# Altium schematic sheet 0043_GPP_MUX_E.SchDoc
size A3
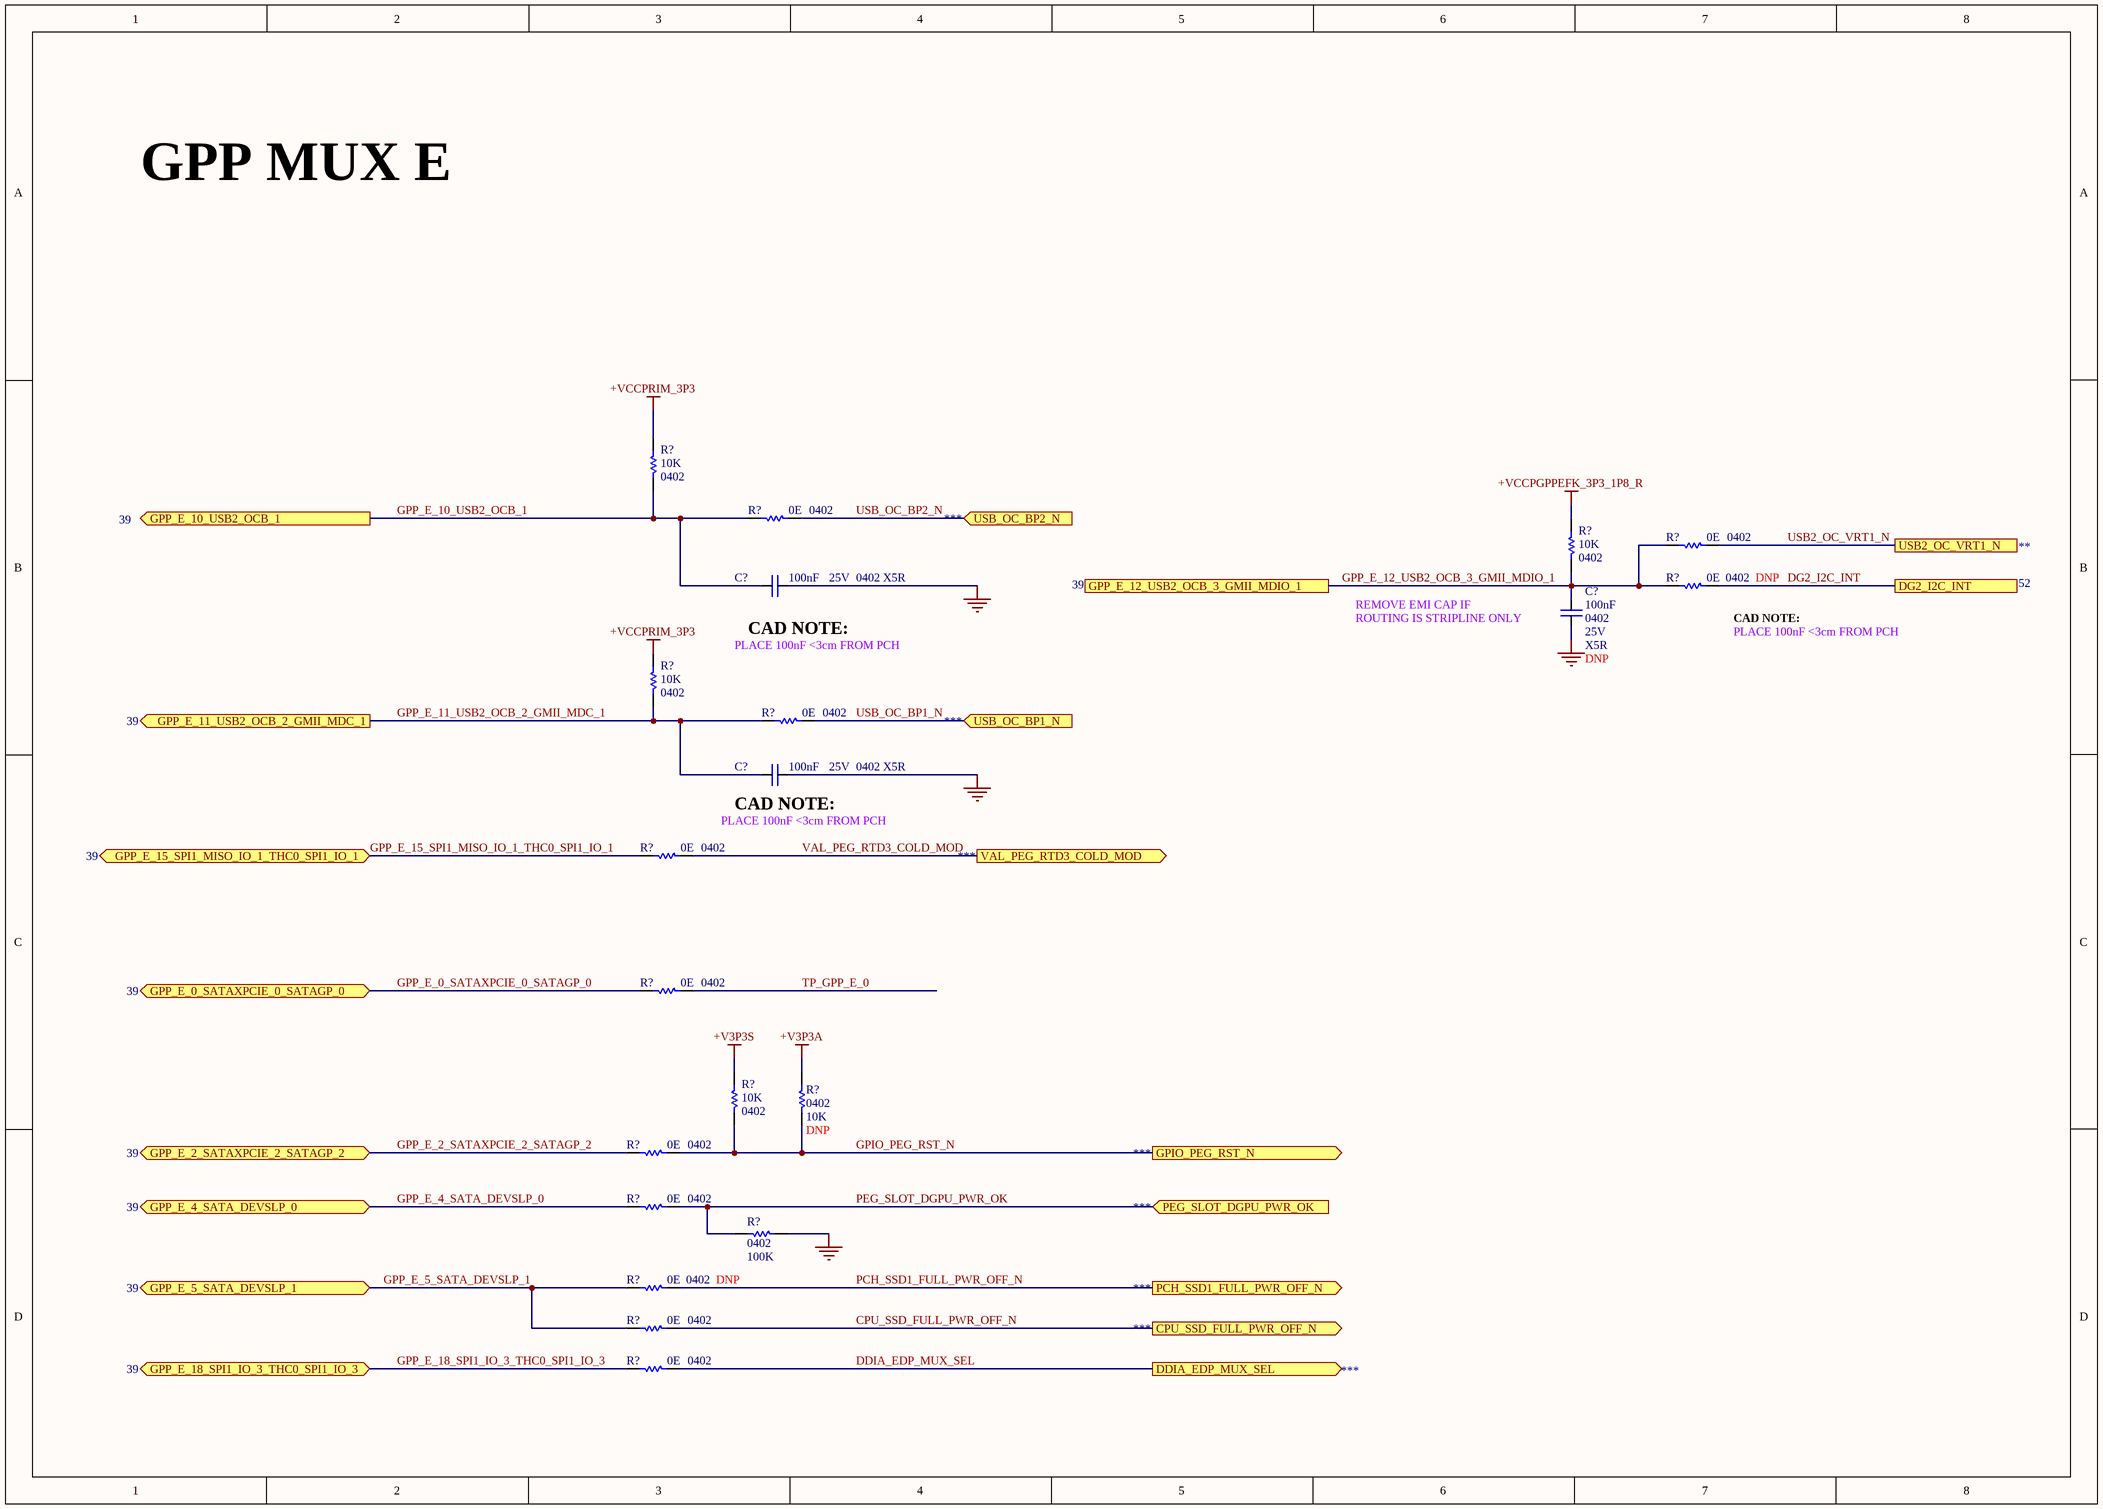
[diagram p0: 0043_GPP_MUX_E.SchDoc]

## Parts
(Parts that share a designator on the sheet are numbered #1, #2 ... from top to bottom, then left to right.)
C?#1  value 100nF  Case/Package: 0402  Voltage: 25V  Dielectric: X5R  [CAPC0402]
C?#2  value 100nF  Case/Package: 0402  Voltage: 25V  Dielectric: X5R  [CAPC0402]
C?#3  value 100nF  Case/Package: 0402  Voltage: 25V  Dielectric: X5R  [CAPC0402]
R?#1  value 10K  Case/Package: 0402  [RESC0402]  (hidden comment: Res)
R?#2  value 0E  Case/Package: 0402  [RESC0402]  (hidden comment: Res)
R?#3  value 10K  Case/Package: 0402  [RESC0402]  (hidden comment: Res)
R?#4  value 0E  Case/Package: 0402  [RESC0402]  (hidden comment: Res)
R?#5  value 0E  Case/Package: 0402  [RESC0402]  (hidden comment: Res)
R?#6  value 10K  Case/Package: 0402  [RESC0402]  (hidden comment: Res)
R?#7  value 0E  Case/Package: 0402  [RESC0402]  (hidden comment: Res)
R?#8  value 0E  Case/Package: 0402  [RESC0402]  (hidden comment: Res)
R?#9  value 0E  Case/Package: 0402  [RESC0402]  (hidden comment: Res)
R?#10  value 10K  Case/Package: 0402  [RESC0402]  (hidden comment: Res)
R?#11  value 10K  Case/Package: 0402  [RESC0402]  (hidden comment: Res)
R?#12  value 0E  Case/Package: 0402  [RESC0402]  (hidden comment: Res)
R?#13  value 0E  Case/Package: 0402  [RESC0402]  (hidden comment: Res)
R?#14  value 100K  Case/Package: 0402  [RESC0402]  (hidden comment: Res)
R?#15  value 0E  Case/Package: 0402  [RESC0402]  (hidden comment: Res)
R?#16  value 0E  Case/Package: 0402  [RESC0402]  (hidden comment: Res)
R?#17  value 0E  Case/Package: 0402  [RESC0402]  (hidden comment: Res)

## Ports
CPU_SSD_FULL_PWR_OFF_N (out), DDIA_EDP_MUX_SEL (out), DG2_I2C_INT, GPIO_PEG_RST_N (out), GPP_E_0_SATAXPCIE_0_SATAGP_0 (bidir), GPP_E_2_SATAXPCIE_2_SATAGP_2 (bidir), GPP_E_4_SATA_DEVSLP_0 (bidir), GPP_E_5_SATA_DEVSLP_1 (bidir), GPP_E_10_USB2_OCB_1 (out), GPP_E_11_USB2_OCB_2_GMII_MDC_1 (out), GPP_E_12_USB2_OCB_3_GMII_MDIO_1, GPP_E_15_SPI1_MISO_IO_1_THC0_SPI1_IO_1 (bidir), GPP_E_18_SPI1_IO_3_THC0_SPI1_IO_3 (bidir), PCH_SSD1_FULL_PWR_OFF_N (out), PEG_SLOT_DGPU_PWR_OK (in), USB2_OC_VRT1_N, USB_OC_BP1_N (in), USB_OC_BP2_N (in), VAL_PEG_RTD3_COLD_MOD (out)

## Nets
+V3P3A: R?#11.2
+V3P3S: R?#10.2
+VCCPGPPEFK_3P3_1P8_R: R?#3.2
+VCCPRIM_3P3: R?#1.2 R?#6.2
GND: C?#1.2 C?#2.1 C?#3.2 R?#14.1
CPU_SSD_FULL_PWR_OFF_N: R?#16.2 ; port CPU_SSD_FULL_PWR_OFF_N
DDIA_EDP_MUX_SEL: R?#17.2 ; port DDIA_EDP_MUX_SEL
DG2_I2C_INT: R?#5.2 ; port DG2_I2C_INT
GPIO_PEG_RST_N: R?#10.1 R?#11.1 R?#12.2 ; port GPIO_PEG_RST_N
GPP_E_0_SATAXPCIE_0_SATAGP_0: R?#9.1 ; port GPP_E_0_SATAXPCIE_0_SATAGP_0
GPP_E_2_SATAXPCIE_2_SATAGP_2: R?#12.1 ; port GPP_E_2_SATAXPCIE_2_SATAGP_2
GPP_E_4_SATA_DEVSLP_0: R?#13.1 ; port GPP_E_4_SATA_DEVSLP_0
GPP_E_5_SATA_DEVSLP_1: R?#15.1 R?#16.1 ; port GPP_E_5_SATA_DEVSLP_1
GPP_E_10_USB2_OCB_1: C?#1.1 R?#1.1 R?#2.1 ; port GPP_E_10_USB2_OCB_1
GPP_E_11_USB2_OCB_2_GMII_MDC_1: C?#3.1 R?#6.1 R?#7.1 ; port GPP_E_11_USB2_OCB_2_GMII_MDC_1
GPP_E_12_USB2_OCB_3_GMII_MDIO_1: C?#2.2 R?#3.1 R?#4.1 R?#5.1 ; port GPP_E_12_USB2_OCB_3_GMII_MDIO_1
GPP_E_15_SPI1_MISO_IO_1_THC0_SPI1_IO_1: R?#8.1 ; port GPP_E_15_SPI1_MISO_IO_1_THC0_SPI1_IO_1
GPP_E_18_SPI1_IO_3_THC0_SPI1_IO_3: R?#17.1 ; port GPP_E_18_SPI1_IO_3_THC0_SPI1_IO_3
PCH_SSD1_FULL_PWR_OFF_N: R?#15.2 ; port PCH_SSD1_FULL_PWR_OFF_N
PEG_SLOT_DGPU_PWR_OK: R?#13.2 R?#14.2 ; port PEG_SLOT_DGPU_PWR_OK
TP_GPP_E_0: R?#9.2
USB2_OC_VRT1_N: R?#4.2 ; port USB2_OC_VRT1_N
USB_OC_BP1_N: R?#7.2 ; port USB_OC_BP1_N
USB_OC_BP2_N: R?#2.2 ; port USB_OC_BP2_N
VAL_PEG_RTD3_COLD_MOD: R?#8.2 ; port VAL_PEG_RTD3_COLD_MOD

## Notes on the sheet
- GPP MUX E
- PLACE 100nF <3cm FROM PCH
- (near C?#1) CAD NOTE:
- REMOVE EMI CAP IF
- ROUTING IS STRIPLINE ONLY
- (near R?#5) CAD NOTE:
- (near R?#5) PLACE 100nF <3cm FROM PCH
- (near C?#3) CAD NOTE:

## Library data of the parts
C?#1-C?#3 = Cap: CAP CER 100nF 25V X5R 0402
  C?#2: DNP: DNP
R?#1 R?#3 R?#6 R?#10 R?#11 = Res: Thick Film Resistor -  10Kohm, 1%, 0402
  R?#11: DNP: DNP
R?#2 R?#4 R?#5 R?#7-R?#9 R?#12 R?#13 R?#15-R?#17 = Res: Thick Film Resistor -  0ohm, 1%, 0402
  R?#5 R?#15: DNP: DNP
R?#14 = Res: Thick Film Resistor -  100Kohm, 1%, 0402